# EAGLE design pc_mlx90632_brk (EAGLE 9.5.2)
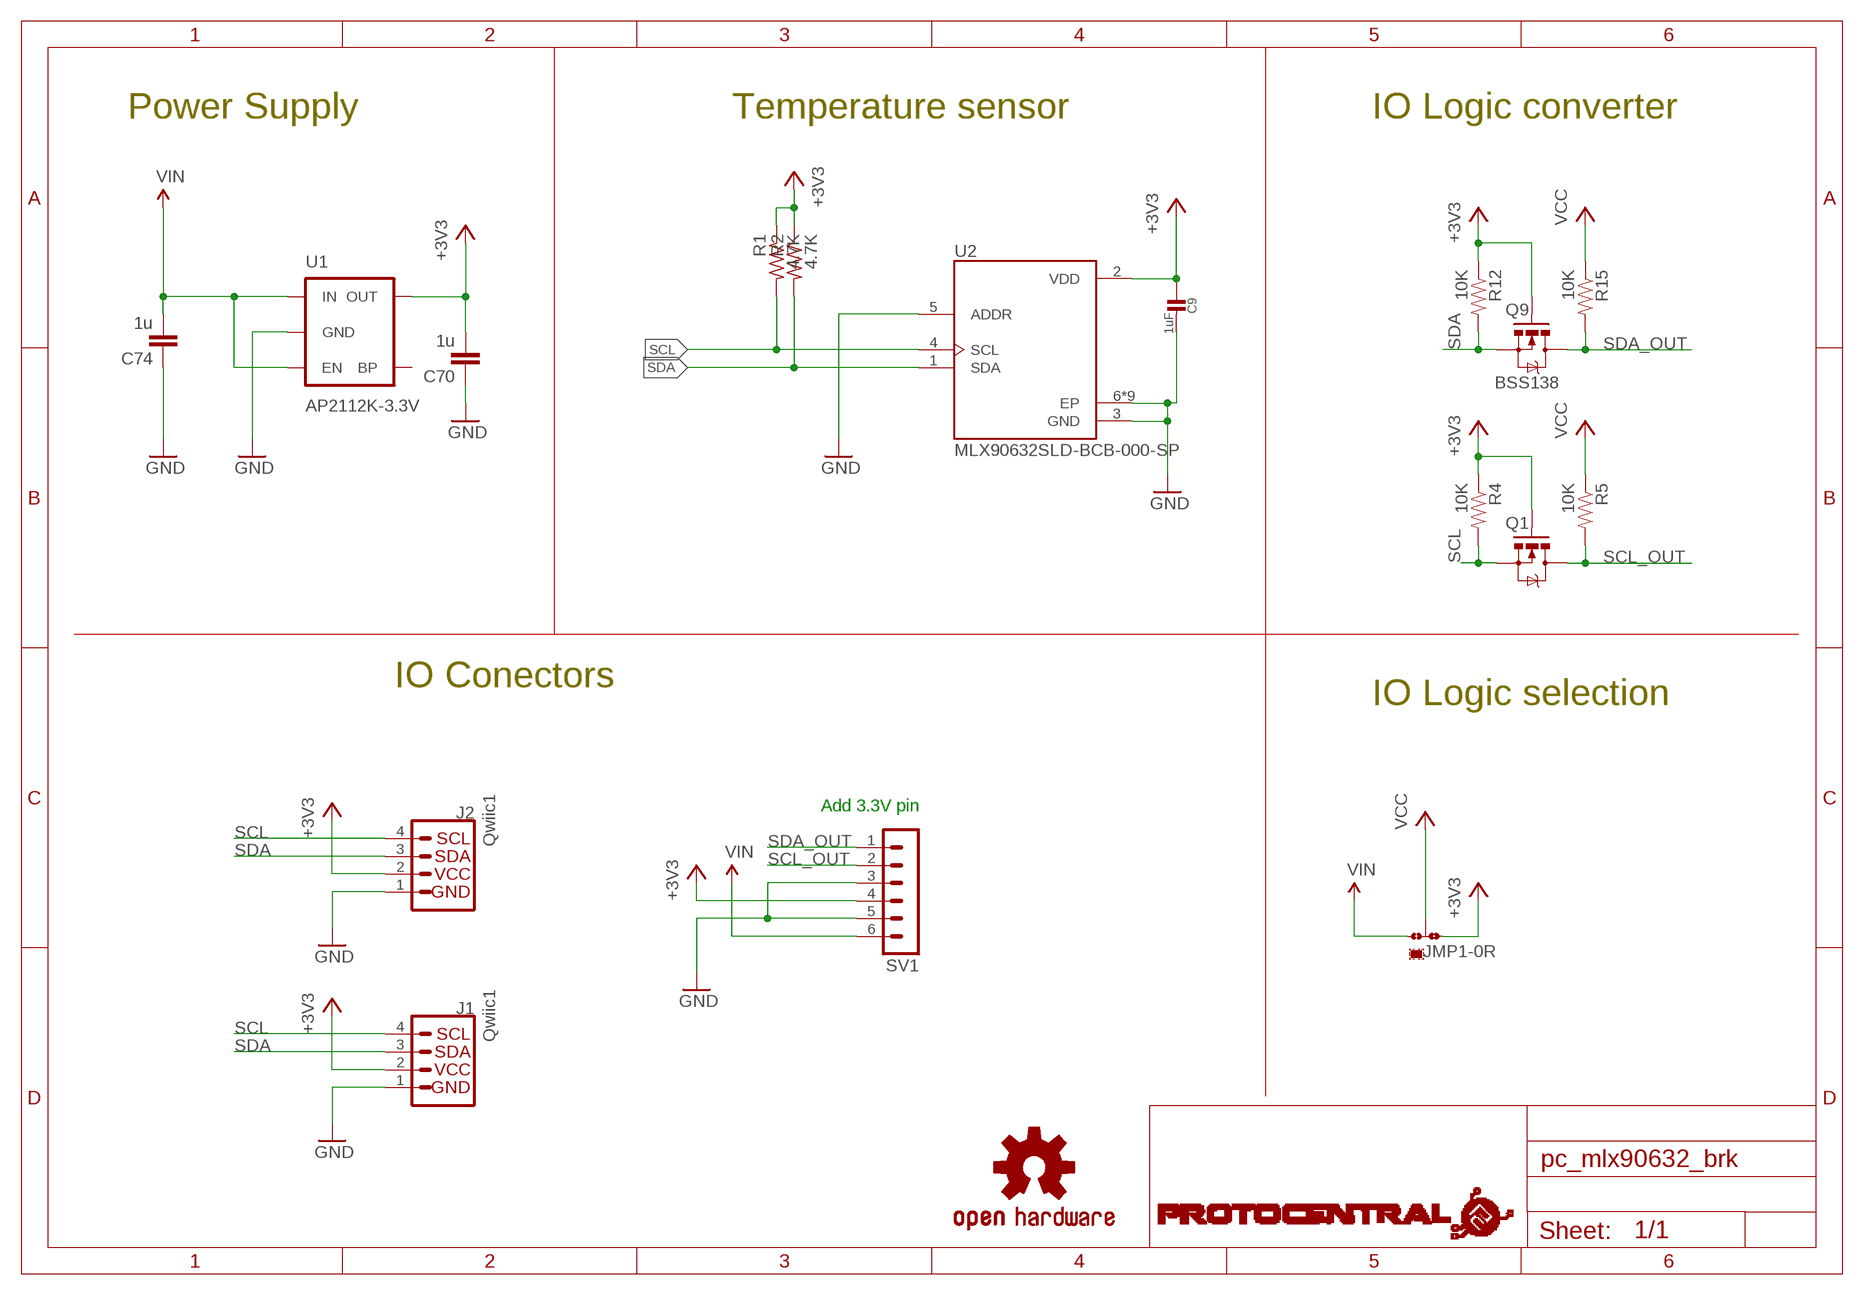
[diagram p0: schematic, sheet 1]

## Parts
C9  1uF  CAP_CERAMIC_0402  [_0402]
C70  1u  C-EUC0805  [C0805]
C74  1u  C-EUC0805  [C0805]
J1  Qwiic1  QWIIC_CONNECTORJS-1MM  [1X04_1MM_RA]
J2  Qwiic1  QWIIC_CONNECTORJS-1MM  [1X04_1MM_RA]
JMP1  0R-JUMPA  [A0R-JMP-0402]
Q1  BSS138  MOSFET-NCHANNELSMD  [SOT23-3]
Q9  BSS138  MOSFET-NCHANNELSMD  [SOT23-3]
R1  4.7K  R-US_R0402  [R0402]
R2  4.7K  R-US_R0402  [R0402]
R4  10K  RESISTOR0805-RES  [0805]
R5  10K  RESISTOR0805-RES  [0805]
R12  10K  RESISTOR0805-RES  [0805]
R15  10K  RESISTOR0805-RES  [0805]
SV1  MA06-1  [MA06-1]
U1  AP2112K-3.3V  V_REG_LDOSMD  [SOT23-5]
U2  MLX90632SLD-BCB-000-SP  [XDCR_MLX90632SLD-BCB-000-SP]
U$5  PROTY-LOGO  [LOGO-PROTY]
U$7  OSHW-LOGOS  [OSHW-LOGO-S]

## Nets
+3V3: C9.1 C70.2 J1.2 J2.2 JMP1.3 Q1.1(G) Q9.1(G) R1.1 R2.1 R4.1 R12.1 SV1.4 U1.5(OUT) U2.2(VDD)
GND [gnd]: C9.2 C70.1 C74.1 J1.1 J2.1 SV1.3 SV1.5 U1.2(GND) U2.3(GND) U2.5(ADDR) U2.6(EP) U2.6.1(EP) U2.6.2(EP) U2.6.3(EP) U2.6.4(EP) U2.6.5(EP) U2.6.6(EP) U2.6.7(EP) U2.6.8(EP)
SCL: J1.4 J2.4 Q1.2(S) R1.2 R4.2 U2.4(SCL)
SCL_OUT: Q1.3(D) R5.2 SV1.2
SDA: J1.3 J2.3 Q9.2(S) R2.2 R12.2 U2.1(SDA)
SDA_OUT: Q9.3(D) R15.2 SV1.1
VCC: JMP1.2 R5.1 R15.1
VIN: C74.2 JMP1.1 SV1.6 U1.1(IN) U1.3(EN)
Unconnected: U1.4(BP)

## Notes on the sheet
- Power Supply | Temperature sensor | IO Logic converter
- IO Conectors
- IO Logic selection
- Add 3.3V pin

## Library data of the parts
C9 = microbuilder:CAP_CERAMIC: Ceramic Capacitors For new designs, use the packages preceded by an '_' character since they are more reliable: The following footprints should be used on most boards: _0402 - Standard footprint for regular board layouts _0603 - Standard footprint for regular board layouts _0805 - Standard footprint for regular board layouts _1206 - Standard footprint for regular board layouts For extremely tight-pitch boards where space is at a premium, the following 'micro-pitch' footprints can be used (smaller pads, no silkscreen outline, etc.): _0402MP - Micro-pitch footprint for very dense/compact boards _0603MP - Micro-pitch footprint for very dense/compact boards _0805MP - Micro-pitch footprint for very dense/compact boards _1206MP - Micro-pitch footprint for very dense/compact boards
C70 C74 = rcl:C-EU: CAPACITOR, European symbol
J1 J2 = SparkFun-Connectors:QWIIC_CONNECTOR: SparkFun I2C Standard Qwiic Connector An SMD 1mm pitch JST connector makes it easy and quick (get it? Qwiic?) to connect I2C devices to each other. The Qwiic system <http://www.sparkfun.com/qwiic> enables fast and solderless connection between popular platforms and various sensors and actuators. We carry 200mm <https://www.sparkfun.com/products/14204>, 100mm <https://www.sparkfun.com/products/14205>, 50mm <https://www.sparkfun.com/products/14206>, and breadboard friendly <https://www.sparkfun.com/products/14207> Qwiic cables. We also offer 10 pcs strips <https://www.sparkfun.com/products/14323> the SMD connectors.; PROD_ID: CONN-13694
JMP1 = circuitects:0R-JUMP: SMD 0R 0402 Jumper
Q1 Q9 = SparkFun:MOSFET-NCHANNEL
R1 R2 = rcl:R-US_: RESISTOR, American symbol
R4 R5 R12 R15 = SparkFun:RESISTOR: Resistor Basic schematic elements and footprints for 0603, 1206, and PTH resistors.
SV1 = con-lstb:MA06-1: PIN HEADER; OC_FARNELL: unknown; OC_NEWARK: unknown
U1 = SparkFun-PowerIC:V_REG_LDO: Voltage Regulator LDO Standard 150mA LDO voltage regulator in SOT-23 layout. Micrel part MIC5205. BP (by-pass) pin is used to lower output noise with 470pF cap.; PROD_ID: VREG-12457
U2 = MLX90632SLD-BCB-000-SP:MLX90632SLD-BCB-000-SP: MLX90632 Surface Mount Miniature Infrared (IR) Thermometer IC; DESCRIPTION: Temperature Sensor Digital, Infrared _IR_ -20°C ~ 85°C 5-SFN _3x3_; DIGI-KEY_PART_NUMBER: MLX90632SLD-BCB-000-SP-ND; DIGI-KEY_PURCHASE_URL: https://www.digikey.in/product-detail/en/melexis-technologies-nv/MLX90632SLD-BCB-000-SP/MLX90632SLD-BCB-000-SP-ND/7916870?utm_source=snapeda&utm_medium=aggregator&utm_campaign=symbol; MF: Melexis Technologies; MP: MLX90632SLD-BCB-000-SP; PACKAGE: 5-TFSFN-5 Melexis
U$5 = circuitects:PROTY-LOGO
U$7 = SparkFun:OSHW-LOGO: Open Source Hardware Logo This logo indicates the piece of hardware it is found on incorporates a OSHW license and/or adheres to the definition of open source hardware found here: http://freedomdefined.org/OSHW

## Net classes
2 gnd: width 0.102 mm, drill 0.1 mm

## Board
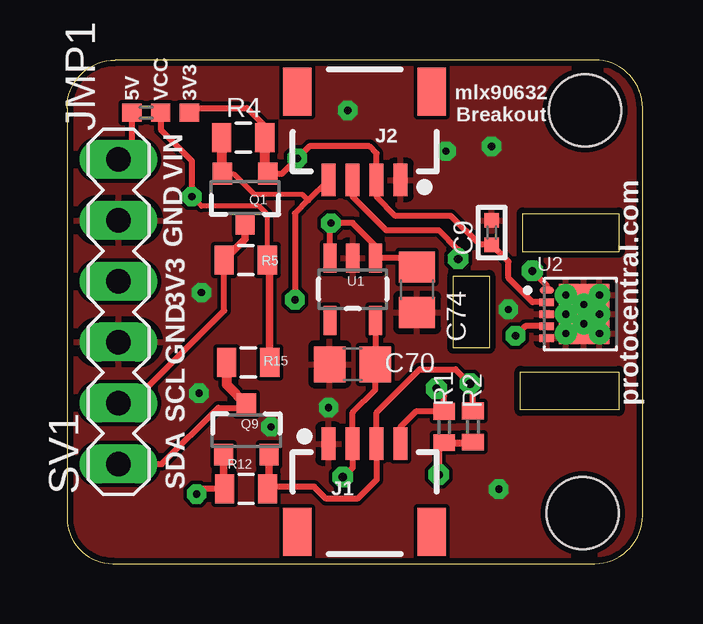
[diagram p1: board, top side]
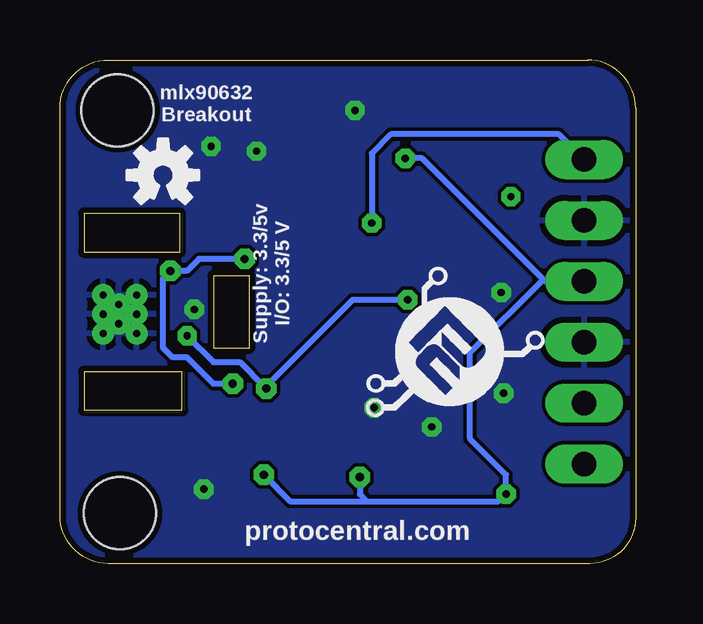
[diagram p2: board, bottom side, seen from below]

Size 24 x 21 mm. Coordinates in mm from the lower left corner, seen from the top.
Outline: 1.9,0 22,0 arc90 24,2 24,19 arc90 22,21 2,21 arc90 0,19 0,1.9 arc90 1.9,0
Outline: 19,14.6 23,14.6 23,13 19,13 19,14.6
Outline: 18.9,8 23,8 23,6.4 18.9,6.4 18.9,8
Outline: 16.1,9 16.1,12 17.6,12 17.6,9 16.1,9
Copper layers (1*2*15*16): Top 0.035mm / dielectric 1.5mm / Route2 0.035mm / dielectric 0.15mm / Route15 0.035mm / dielectric 0.2mm / Bottom 0.035mm
Design rules "Circuitects-Rules": minimum track width 6mil, minimum drill 0.3mm, track to track 6mil, track to pad 6mil, pad to pad 6mil, via to via 6mil, smd to smd 6mil, copper to edge 10mil, drill to drill 8mil, minimum pad ring 12mil, minimum via ring 10mil, stop-mask expansion 4mil, vias tented up to drill 25mil, thermal gap 10mil
Holes 3 mm at 21.5,2.1 21.6,18.9

### Footprints (pad centres in the part's own frame; a part is rotated, then mirrored left to right if it is on the bottom)
_0402 = smd 0.6 x 0.6: 1 -0.508,0; 2 0.508,0
C0805 = smd 1.3 x 1.5: 1 -0.95,0; 2 0.95,0
1X04_1MM_RA = smd 0.6 x 1.35: 1 -1.5,0; 2 -0.5,0; 3 0.5,0; 4 1.5,0 | smd 1.2 x 2: NC1 2.8,-3.675; NC2 -2.8,-3.675
A0R-JMP-0402 = smd 0.74 x 0.8: 1 0,1.2; 2 0,0; 3 0,-1.2
SOT23-3 = smd 0.8 x 0.9: 1 -0.95,-1; 2 0.95,-1; 3 0,1.1
R0402 = smd 0.7 x 0.9: 1 -0.65,0; 2 0.65,0
0805 = smd 0.8 x 1.2: 1 -0.9,0; 2 0.9,0
MA06-1 = drill 1.016 long: 1 -6.35,0; 2 -3.81,0; 3 -1.27,0; 4 1.27,0; 5 3.81,0; 6 6.35,0
SOT23-5 = smd 0.55 x 1.2: 1 -0.95,-1.3; 2 0,-1.3; 3 0.95,-1.3; 4 0.95,1.3; 5 -0.95,1.3
XDCR_MLX90632SLD-BCB-000-SP = smd 0.6 x 0.3: 1 -1.4,1; 2 -1.4,0.5; 3 -1.4,0; 4 -1.4,-0.5; 5 -1.4,-1 | smd 2.1 x 2.5: 6 0.15,0 | drill 0.3 pad 0.4: 6.1 0.8,0.8; 6.2 0.8,0; 6.3 0.8,-0.8; 6.4 0.15,0.4; 6.5 0.15,-0.4; 6.6 -0.6,0.8; 6.7 -0.6,0; 6.8 -0.6,-0.8

### Placement (x,y rotation side)
C9  17.7,13.8 90 top
C70  11.9,8.31 0 top
C74  14.59,11.42 90 top
J1  12.4,5 0 top
J2  12.4,16 180 top
JMP1  3.9,18.8 90 top
Q1  7.42,15.26 180 top
Q9  7.47,5.54 0 top
R1  15.72,5.69 90 top
R2  16.92,5.71 90 top
R4  7.34,17.76 180 top
R5  7.45,12.66 180 top
R12  7.46,3.12 0 top
R15  7.55,8.38 180 top
SV1  2.14,10.5 90 top
U1  11.91,11.44 180 top
U2  21.4,10.4 0 top
U$5  11.3,6 0 bottom
U$7  19.7,16.2 0 bottom

### Tracks (layer width: path | path; a pad name or v marks a point on that pad's centre or on a via)
+3V3  (via drill 0.3, 0.35)
  Top 0.152: Q1.1 8.37,16.23
  Top 0.254: R12.1 5.62,3.12 v5.4,2.9 | Q1.1 8.96,16.26 v9.6,16.9 10.1,17.4 12.6,17.4 12.9,17.1 J2.2 12.9,15.3 13.7,14.5 16,14.5 17.21,13.29 C9.1 18.4,12.59 18.4,11.9 19.4,10.9 U2.2 | JMP1.3 5.3,19 7.5,19 8.24,18.26 R4.1 | U1.5 C70.2 12.85,7.25 11.9,6.3 J1.2 11.9,4 v11.5,3.6 | R1.1 15.5,4.82 v15.5,3.7
  Top 0.3: R1.1 15.76,5.04 17.2,5.04 R2.1
  Top 0.305: Q9.1 6.52,3.16 R12.1 | 15.76,5.04 15.46,5.04
  Top 0.406: R4.1 8.24,16.39 Q1.1
  Bottom 0.254: SV1.4 3.77,11.77 3.85,11.85 | 3.85,11.85 8.9,16.9 v9.6,16.9 | 11.2,2.6 14.4,2.6 v15.5,3.7 | 11.2,2.6 5.7,2.6 v5.4,2.9 5.4,3.7 6.9,5.2 6.9,8.8 3.85,11.85 | v11.5,3.6 11.5,2.9 11.2,2.6
GND  (via drill 0.3)
  Bottom 0.254: U2.6.4 U2.6.5 21.15,10.4 U2.6.7
  other vias: 15.8,17.2 17.7,17.4 18,3.1 11.7,18.9 18.4,10.6 5.5,7.1 10.9,6.5 8.5,5.7 5.6,11.3
  pour Top: 0.2,21 24.6,21 24.37,0 -0.03,0
  pour Bottom: 0.2,21 24.6,21 24.37,0 -0.03,0
SCL  (via drill 0.3, 0.35)
  Top 0.2: Q1.2 6.94,16.26 7.8,15.4 9.8,15.4 10.05,15.15
  Top 0.254: J2.4 10.05,15.15 9.5,14.6 v9.5,11 | J1.4 13.9,5.7 14.54,6.34 R1.2 15.72,6.98 v15.4,7.3 | U2.4 19.1,9.9 v18.7,9.5
  Top 0.406: R4.2 6.44,16.29 Q1.2
  Bottom 0.254: v18.7,9.5 17.6,8.4 16.5,8.4 15.45,7.35 | v15.4,7.3 15.45,7.35 | v9.5,11 11.8,11 15.45,7.35
SCL_OUT
  Top 0.254: SV1.2 2.69,6.69 6.55,10.55 R5.2
  Top 0.305: Q1.3 7.42,13.53 R5.2
SDA  (via drill 0.35)
  Top 0.254: 8.42,3.18 8.44,3.2 10.3,3.2 10.8,2.7 12.1,2.7 12.9,3.5 J1.3 12.9,6.3 14.7,8.1 16.2,8.1 v16.8,7.5 16.92,7.38 R2.2 | J2.3 11.9,15.3 13.3,13.9 15.5,13.9 16.3,13.1 v16.3,12.7 | U2.1 20,11.6 v19.4,12.2
  Top 0.305: Q9.2 8.42,3.18 R12.2
  Bottom 0.254: v16.8,7.5 17.6,7.5 18.7,8.6 19.3,8.6 19.7,9 19.7,11.9 v19.4,12.2 18.7,12.2 18.2,12.7 v16.3,12.7
SDA_OUT
  Top 0.254: SV1.1 3.95,4.15 6.3,6.5 7.33,6.5
  Top 0.406: R15.2 6.65,7.46 Q9.3 7.33,6.5
VCC  (via drill 0.3)
  Top 0.2: R5.1 8.35,14.55 8,14.9 5.6,14.9 v5.2,15.3
  Top 0.254: JMP1.2 3.9,18.1 5.2,16.8 v5.2,15.3
  Top 0.305: R5.1 8.45,12.56 R15.1 8.57,8.5
VIN  (via drill 0.3)
  Top 0.254: JMP1.1 2.7,17.41 SV1.6 | U1.3 10.96,14.16 v11,14.2 11.9,14.2 12.86,13.24 U1.1 14.22,12.74 C74.2
  Bottom 0.254: SV1.6 3.19,17.9 10.2,17.9 11,17.1 v11,14.2

### Text on the board
tPlace: 5V | VCC | 3V3 | mlx90632 / Breakout | VIN | protocentral.com | GND | 3V3 | GND | SCL | SDA
bPlace: mlx90632 / Breakout | Supply: 3.3/5v / I/O: 3.3/5 V | protocentral.com